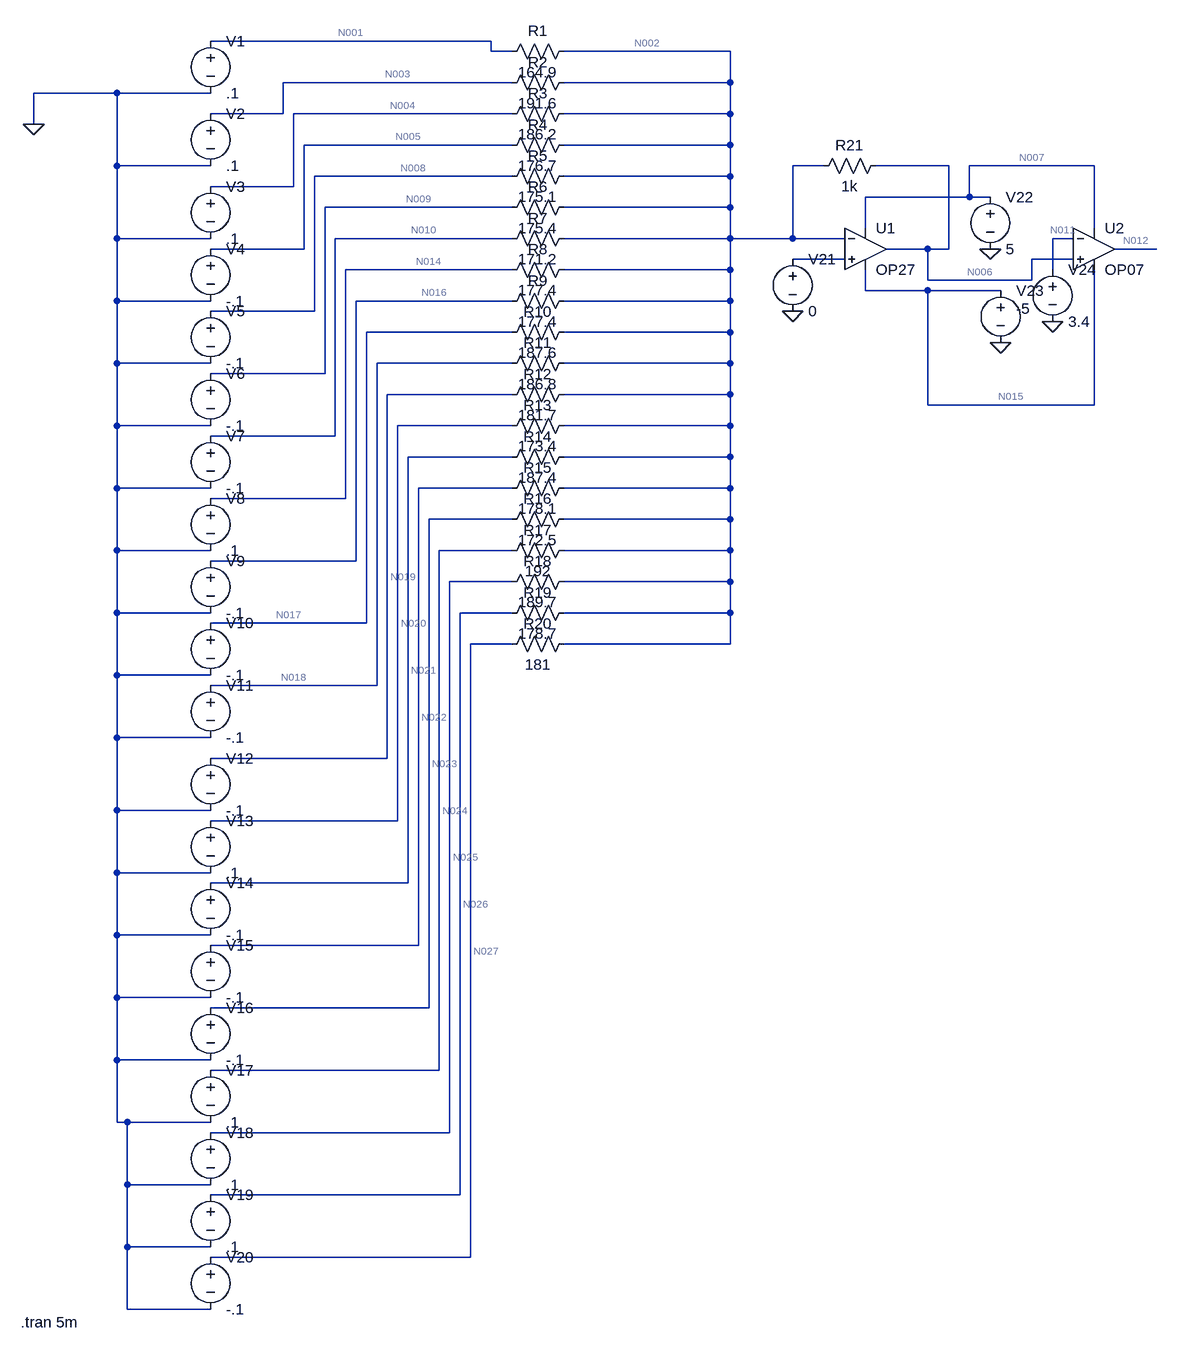
[diagram p0: schematic pattern_resistor.asc]
pattern_resistor.asc, the LTspice schematic file:
Version 4
SHEET 1 1460 2164
WIRE 432 176 0 176
WIRE 432 192 432 176
WIRE 464 192 432 192
WIRE 800 192 544 192
WIRE 464 240 112 240
WIRE 800 240 800 192
WIRE 800 240 544 240
WIRE -144 256 -272 256
WIRE 0 256 -144 256
WIRE 112 288 112 240
WIRE 112 288 0 288
WIRE 464 288 128 288
WIRE 800 288 800 240
WIRE 800 288 544 288
WIRE -272 304 -272 256
WIRE 464 336 144 336
WIRE 800 336 800 288
WIRE 800 336 544 336
WIRE -144 368 -144 256
WIRE 0 368 -144 368
WIRE 944 368 896 368
WIRE 1136 368 1024 368
WIRE 1360 368 1168 368
WIRE 464 384 160 384
WIRE 800 384 800 336
WIRE 800 384 544 384
WIRE 128 400 128 288
WIRE 128 400 0 400
WIRE 1168 416 1168 368
WIRE 1168 416 1008 416
WIRE 1200 416 1168 416
WIRE 464 432 176 432
WIRE 800 432 800 384
WIRE 800 432 544 432
WIRE 1008 464 1008 416
WIRE 1360 464 1360 368
WIRE -144 480 -144 368
WIRE 0 480 -144 480
WIRE 464 480 192 480
WIRE 800 480 800 432
WIRE 800 480 544 480
WIRE 896 480 896 368
WIRE 896 480 800 480
WIRE 976 480 896 480
WIRE 1328 480 1296 480
WIRE 144 496 144 336
WIRE 144 496 0 496
WIRE 1104 496 1040 496
WIRE 1136 496 1136 368
WIRE 1136 496 1104 496
WIRE 1456 496 1392 496
WIRE 976 512 896 512
WIRE 1328 512 1264 512
WIRE 464 528 208 528
WIRE 800 528 800 480
WIRE 800 528 544 528
WIRE 1296 528 1296 480
WIRE 1104 544 1104 496
WIRE 1264 544 1264 512
WIRE 1264 544 1104 544
WIRE 1008 560 1008 528
WIRE 1104 560 1008 560
WIRE 1216 560 1104 560
WIRE -144 576 -144 480
WIRE 0 576 -144 576
WIRE 464 576 224 576
WIRE 800 576 800 528
WIRE 800 576 544 576
WIRE 160 592 160 384
WIRE 160 592 0 592
WIRE 464 624 240 624
WIRE 800 624 800 576
WIRE 800 624 544 624
WIRE -144 672 -144 576
WIRE 0 672 -144 672
WIRE 464 672 256 672
WIRE 800 672 800 624
WIRE 800 672 544 672
WIRE 176 688 176 432
WIRE 176 688 0 688
WIRE 464 720 272 720
WIRE 800 720 800 672
WIRE 800 720 544 720
WIRE 1104 736 1104 560
WIRE 1360 736 1360 528
WIRE 1360 736 1104 736
WIRE -144 768 -144 672
WIRE 0 768 -144 768
WIRE 464 768 288 768
WIRE 800 768 800 720
WIRE 800 768 544 768
WIRE 192 784 192 480
WIRE 192 784 0 784
WIRE 464 816 304 816
WIRE 800 816 800 768
WIRE 800 816 544 816
WIRE -144 864 -144 768
WIRE 0 864 -144 864
WIRE 464 864 320 864
WIRE 800 864 800 816
WIRE 800 864 544 864
WIRE 208 880 208 528
WIRE 208 880 0 880
WIRE 464 912 336 912
WIRE 800 912 800 864
WIRE 800 912 544 912
WIRE -144 960 -144 864
WIRE 0 960 -144 960
WIRE 464 960 352 960
WIRE 800 960 800 912
WIRE 800 960 544 960
WIRE 224 976 224 576
WIRE 224 976 0 976
WIRE 464 1008 368 1008
WIRE 800 1008 800 960
WIRE 800 1008 544 1008
WIRE -144 1056 -144 960
WIRE 0 1056 -144 1056
WIRE 464 1056 384 1056
WIRE 800 1056 800 1008
WIRE 800 1056 544 1056
WIRE 240 1072 240 624
WIRE 240 1072 0 1072
WIRE 464 1104 400 1104
WIRE 800 1104 800 1056
WIRE 800 1104 544 1104
WIRE -144 1152 -144 1056
WIRE 0 1152 -144 1152
WIRE 256 1168 256 672
WIRE 256 1168 0 1168
WIRE -144 1248 -144 1152
WIRE 0 1248 -144 1248
WIRE 272 1280 272 720
WIRE 272 1280 0 1280
WIRE -144 1360 -144 1248
WIRE 0 1360 -144 1360
WIRE 288 1376 288 768
WIRE 288 1376 0 1376
WIRE -144 1456 -144 1360
WIRE 0 1456 -144 1456
WIRE 304 1472 304 816
WIRE 304 1472 0 1472
WIRE -144 1552 -144 1456
WIRE 0 1552 -144 1552
WIRE 320 1568 320 864
WIRE 320 1568 0 1568
WIRE -144 1648 -144 1552
WIRE 0 1648 -144 1648
WIRE 336 1664 336 912
WIRE 336 1664 0 1664
WIRE -144 1744 -144 1648
WIRE 0 1744 -144 1744
WIRE 352 1760 352 960
WIRE 352 1760 0 1760
WIRE -144 1840 -144 1744
WIRE -128 1840 -144 1840
WIRE 0 1840 -128 1840
WIRE 368 1856 368 1008
WIRE 368 1856 0 1856
WIRE -128 1936 -128 1840
WIRE 0 1936 -128 1936
WIRE 384 1952 384 1056
WIRE 384 1952 0 1952
WIRE -128 2032 -128 1936
WIRE 0 2032 -128 2032
WIRE 400 2048 400 1104
WIRE 400 2048 0 2048
WIRE -128 2128 -128 2032
WIRE 0 2128 -128 2128
FLAG -272 304 0
FLAG 896 592 0
FLAG 1200 496 0
FLAG 1216 640 0
FLAG 1296 608 0
SYMBOL res 560 176 R90
WINDOW 0 0 56 VBottom 2
WINDOW 3 32 56 VTop 2
SYMATTR InstName R1
SYMATTR Value 164.9
SYMBOL res 560 224 R90
WINDOW 0 0 56 VBottom 2
WINDOW 3 32 56 VTop 2
SYMATTR InstName R2
SYMATTR Value 191.6
SYMBOL res 560 272 R90
WINDOW 0 0 56 VBottom 2
WINDOW 3 32 56 VTop 2
SYMATTR InstName R3
SYMATTR Value 186.2
SYMBOL res 560 320 R90
WINDOW 0 0 56 VBottom 2
WINDOW 3 32 56 VTop 2
SYMATTR InstName R4
SYMATTR Value 176.7
SYMBOL res 560 368 R90
WINDOW 0 0 56 VBottom 2
WINDOW 3 32 56 VTop 2
SYMATTR InstName R5
SYMATTR Value 175.1
SYMBOL res 560 416 R90
WINDOW 0 0 56 VBottom 2
WINDOW 3 32 56 VTop 2
SYMATTR InstName R6
SYMATTR Value 175.4
SYMBOL res 560 464 R90
WINDOW 0 0 56 VBottom 2
WINDOW 3 32 56 VTop 2
SYMATTR InstName R7
SYMATTR Value 171.2
SYMBOL res 560 512 R90
WINDOW 0 0 56 VBottom 2
WINDOW 3 32 56 VTop 2
SYMATTR InstName R8
SYMATTR Value 177.4
SYMBOL res 560 560 R90
WINDOW 0 0 56 VBottom 2
WINDOW 3 32 56 VTop 2
SYMATTR InstName R9
SYMATTR Value 177.4
SYMBOL res 560 608 R90
WINDOW 0 0 56 VBottom 2
WINDOW 3 32 56 VTop 2
SYMATTR InstName R10
SYMATTR Value 187.6
SYMBOL res 560 656 R90
WINDOW 0 0 56 VBottom 2
WINDOW 3 32 56 VTop 2
SYMATTR InstName R11
SYMATTR Value 186.8
SYMBOL res 560 704 R90
WINDOW 0 0 56 VBottom 2
WINDOW 3 32 56 VTop 2
SYMATTR InstName R12
SYMATTR Value 181.7
SYMBOL res 560 752 R90
WINDOW 0 0 56 VBottom 2
WINDOW 3 32 56 VTop 2
SYMATTR InstName R13
SYMATTR Value 173.4
SYMBOL res 560 800 R90
WINDOW 0 0 56 VBottom 2
WINDOW 3 32 56 VTop 2
SYMATTR InstName R14
SYMATTR Value 187.4
SYMBOL res 560 848 R90
WINDOW 0 0 56 VBottom 2
WINDOW 3 32 56 VTop 2
SYMATTR InstName R15
SYMATTR Value 178.1
SYMBOL res 560 896 R90
WINDOW 0 0 56 VBottom 2
WINDOW 3 32 56 VTop 2
SYMATTR InstName R16
SYMATTR Value 172.5
SYMBOL res 560 944 R90
WINDOW 0 0 56 VBottom 2
WINDOW 3 32 56 VTop 2
SYMATTR InstName R17
SYMATTR Value 192
SYMBOL res 560 992 R90
WINDOW 0 0 56 VBottom 2
WINDOW 3 32 56 VTop 2
SYMATTR InstName R18
SYMATTR Value 189.7
SYMBOL res 560 1040 R90
WINDOW 0 0 56 VBottom 2
WINDOW 3 32 56 VTop 2
SYMATTR InstName R19
SYMATTR Value 178.7
SYMBOL res 560 1088 R90
WINDOW 0 0 56 VBottom 2
WINDOW 3 32 56 VTop 2
SYMATTR InstName R20
SYMATTR Value 181
SYMBOL Opamps\\OP27 1008 432 R0
SYMATTR InstName U1
SYMBOL res 1040 352 R90
WINDOW 0 0 56 VBottom 2
WINDOW 3 32 56 VTop 2
SYMATTR InstName R21
SYMATTR Value 1k
SYMBOL voltage 0 160 R0
WINDOW 123 0 0 Left 2
WINDOW 39 0 0 Left 2
SYMATTR InstName V1
SYMATTR Value .1
SYMBOL voltage 0 272 R0
WINDOW 123 0 0 Left 2
WINDOW 39 0 0 Left 2
SYMATTR InstName V2
SYMATTR Value .1
SYMBOL voltage 0 384 R0
WINDOW 123 0 0 Left 2
WINDOW 39 0 0 Left 2
SYMATTR InstName V3
SYMATTR Value .1
SYMBOL voltage 0 480 R0
WINDOW 123 0 0 Left 2
WINDOW 39 0 0 Left 2
SYMATTR InstName V4
SYMATTR Value -.1
SYMBOL voltage 0 576 R0
WINDOW 123 0 0 Left 2
WINDOW 39 0 0 Left 2
SYMATTR InstName V5
SYMATTR Value -.1
SYMBOL voltage 0 672 R0
WINDOW 123 0 0 Left 2
WINDOW 39 0 0 Left 2
SYMATTR InstName V6
SYMATTR Value -.1
SYMBOL voltage 0 768 R0
WINDOW 123 0 0 Left 2
WINDOW 39 0 0 Left 2
SYMATTR InstName V7
SYMATTR Value -.1
SYMBOL voltage 0 864 R0
WINDOW 123 0 0 Left 2
WINDOW 39 0 0 Left 2
SYMATTR InstName V8
SYMATTR Value .1
SYMBOL voltage 0 960 R0
WINDOW 123 0 0 Left 2
WINDOW 39 0 0 Left 2
SYMATTR InstName V9
SYMATTR Value -.1
SYMBOL voltage 0 1056 R0
WINDOW 123 0 0 Left 2
WINDOW 39 0 0 Left 2
SYMATTR InstName V10
SYMATTR Value -.1
SYMBOL voltage 0 1152 R0
WINDOW 123 0 0 Left 2
WINDOW 39 0 0 Left 2
SYMATTR InstName V11
SYMATTR Value -.1
SYMBOL voltage 0 1264 R0
WINDOW 123 0 0 Left 2
WINDOW 39 0 0 Left 2
SYMATTR InstName V12
SYMATTR Value -.1
SYMBOL voltage 0 1360 R0
WINDOW 123 0 0 Left 2
WINDOW 39 0 0 Left 2
SYMATTR InstName V13
SYMATTR Value .1
SYMBOL voltage 0 1456 R0
WINDOW 123 0 0 Left 2
WINDOW 39 0 0 Left 2
SYMATTR InstName V14
SYMATTR Value -.1
SYMBOL voltage 0 1552 R0
WINDOW 123 0 0 Left 2
WINDOW 39 0 0 Left 2
SYMATTR InstName V15
SYMATTR Value -.1
SYMBOL voltage 0 1648 R0
WINDOW 123 0 0 Left 2
WINDOW 39 0 0 Left 2
SYMATTR InstName V16
SYMATTR Value -.1
SYMBOL voltage 0 1744 R0
WINDOW 123 0 0 Left 2
WINDOW 39 0 0 Left 2
SYMATTR InstName V17
SYMATTR Value .1
SYMBOL voltage 0 1840 R0
WINDOW 123 0 0 Left 2
WINDOW 39 0 0 Left 2
SYMATTR InstName V18
SYMATTR Value .1
SYMBOL voltage 0 1936 R0
WINDOW 123 0 0 Left 2
WINDOW 39 0 0 Left 2
SYMATTR InstName V19
SYMATTR Value .1
SYMBOL voltage 0 2032 R0
WINDOW 123 0 0 Left 2
WINDOW 39 0 0 Left 2
SYMATTR InstName V20
SYMATTR Value -.1
SYMBOL voltage 896 496 R0
WINDOW 123 0 0 Left 2
WINDOW 39 0 0 Left 2
SYMATTR InstName V21
SYMATTR Value 0
SYMBOL voltage 1200 400 R0
WINDOW 123 0 0 Left 2
WINDOW 39 0 0 Left 2
SYMATTR InstName V22
SYMATTR Value 5
SYMBOL voltage 1216 544 R0
WINDOW 3 24 44 Left 2
WINDOW 123 0 0 Left 2
WINDOW 39 0 0 Left 2
SYMATTR InstName V23
SYMATTR Value -5
SYMBOL voltage 1296 512 R0
WINDOW 123 0 0 Left 2
WINDOW 39 0 0 Left 2
SYMATTR InstName V24
SYMATTR Value 3.4
SYMBOL Opamps\\OP07 1360 432 R0
SYMATTR InstName U2
TEXT -292 2148 Left 2 !.tran 5m

The netlist it stands for:
* pattern_resistor.asc
R1 N002 N001 164.9
R2 N002 N003 191.6
R3 N002 N004 186.2
R4 N002 N005 176.7
R5 N002 N008 175.1
R6 N002 N009 175.4
R7 N002 N010 171.2
R8 N002 N014 177.4
R9 N002 N016 177.4
R10 N002 N017 187.6
R11 N002 N018 186.8
R12 N002 N019 181.7
R13 N002 N020 173.4
R14 N002 N021 187.4
R15 N002 N022 178.1
R16 N002 N023 172.5
R17 N002 N024 192
R18 N002 N025 189.7
R19 N002 N026 178.7
R20 N002 N027 181
XU1 N013 N002 N007 N015 N006 OP27  ; pins In+ In- V+ V- OUT
R21 N006 N002 1k
V1 N001 0 .1
V2 N003 0 .1
V3 N004 0 .1
V4 N005 0 -.1
V5 N008 0 -.1
V6 N009 0 -.1
V7 N010 0 -.1
V8 N014 0 .1
V9 N016 0 -.1
V10 N017 0 -.1
V11 N018 0 -.1
V12 N019 0 -.1
V13 N020 0 .1
V14 N021 0 -.1
V15 N022 0 -.1
V16 N023 0 -.1
V17 N024 0 .1
V18 N025 0 .1
V19 N026 0 .1
V20 N027 0 -.1
V21 N013 0 0
V22 N007 0 5
V23 N015 0 -5
V24 N011 0 3.4
XU2 N006 N011 N007 N015 N012 LT1001  ; OP07, pins In+ In- V+ V- OUT
.tran 5m
.lib ADI.lib
.lib LTC.lib
.backanno
.end

* Results of the author's LTspice run, read from the files saved beside the schematic
* Operating Point, zero values left out:
*   V(n002) = -110.3 nV
*   V(n001) = 100 mV
*   V(n003) = 100 mV
*   V(n004) = 100 mV
*   V(n005) = -100 mV
*   V(n008) = -100 mV
*   V(n009) = -100 mV
*   V(n010) = -100 mV
*   V(n014) = 100 mV
*   V(n016) = -100 mV
*   V(n017) = -100 mV
*   V(n018) = -100 mV
*   V(n019) = -100 mV
*   V(n020) = 100 mV
*   V(n021) = -100 mV
*   V(n022) = -100 mV
*   V(n023) = -100 mV
*   V(n024) = 100 mV
*   V(n025) = 100 mV
*   V(n026) = 100 mV
*   V(n027) = -100 mV
*   V(n007) = 5 V
*   V(n006) = 2.288 V
*   V(n015) = -5 V
*   V(n011) = 3.4 V
*   V(n012) = -4.07 V
*   I(R21) = 2.288 mA
*   I(R20) = 552.5 µA
*   I(R19) = -559.6 µA
*   I(R18) = -527.1 µA
*   I(R17) = -520.8 µA
*   I(R16) = 579.7 µA
*   I(R15) = 561.5 µA
*   I(R14) = 533.6 µA
*   I(R13) = -576.7 µA
*   I(R12) = 550.4 µA
*   I(R11) = 535.3 µA
*   I(R10) = 533 µA
*   I(R9) = 563.7 µA
*   I(R8) = -563.7 µA
*   I(R7) = 584.1 µA
*   I(R6) = 570.1 µA
*   I(R5) = 571.1 µA
*   I(R4) = 565.9 µA
*   I(R3) = -537.1 µA
*   I(R2) = -521.9 µA
*   I(R1) = -606.4 µA
*   I(V24) = -5.507 µA
*   I(V23) = 4.023 mA
*   I(V22) = -6.312 mA
*   I(V20) = 552.5 µA
*   I(V19) = -559.6 µA
*   I(V18) = -527.1 µA
*   I(V17) = -520.8 µA
*   I(V16) = 579.7 µA
*   I(V15) = 561.5 µA
*   I(V14) = 533.6 µA
*   I(V13) = -576.7 µA
*   I(V12) = 550.4 µA
*   I(V11) = 535.3 µA
*   I(V10) = 533 µA
*   I(V9) = 563.7 µA
*   I(V8) = -563.7 µA
*   I(V7) = 584.1 µA
*   I(V6) = 570.1 µA
*   I(V5) = 571.1 µA
*   I(V4) = 565.9 µA
*   I(V3) = -537.1 µA
*   I(V2) = -521.9 µA
*   I(V1) = -606.4 µA
*   Ix(u1:3) = 4.058 mA
*   Ix(u1:4) = -1.776 mA
*   Ix(u1:5) = -2.282 mA
*   Ix(u2:1) = -5.507 µA
*   Ix(u2:2) = 5.507 µA
*   Ix(u2:3) = 2.254 mA
*   Ix(u2:4) = -2.247 mA
*   Ix(u2:5) = 8.141 pA
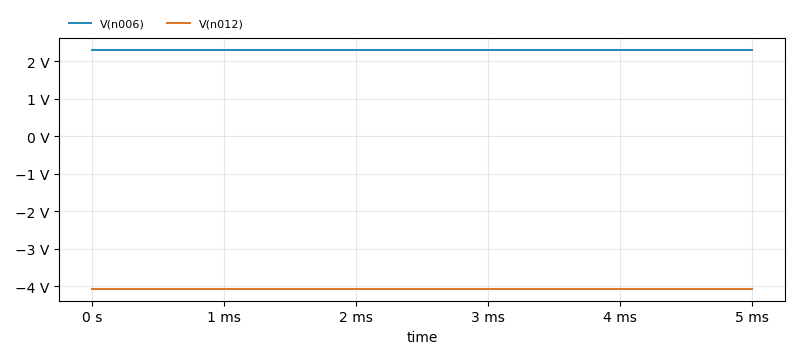
[diagram p1: Transient Analysis of pattern_resistor.asc, plotted from the saved traces]
* Transient Analysis, 1 run:
*   V(n006): min 2.288 V, max 2.288 V, average 2.288 V, rms 2.288 V, last 2.288 V
*   V(n012): min -4.07 V, max -4.07 V, average -4.07 V, rms 4.07 V, last -4.07 V